# Altium schematic sheet 02_ESP12.SchDoc: ESP12 Housing Board
size A4; SheetNumber: 1; SheetTotal: 3; PageSetup: Record=PageOptions|CenterHorizontal=True|CenterVertical=True|PrintScale=1.09|XCorrection=1.00|YCorrection=1.00|PrintKind=0|BorderSize=5000000|LeftOffset=0|BottomOffset=0|Orientation=2|PaperLength=1000|PaperWidth=1000|Scale=100|PaperSource=7|PrintQuality=-3|MediaType=1|DitherType=10|PrintScaleMode=1|PaperKind=A4|PaperIndex=9; SK_ProjectName: ESP8266 IoT Dimmer; Version: R01
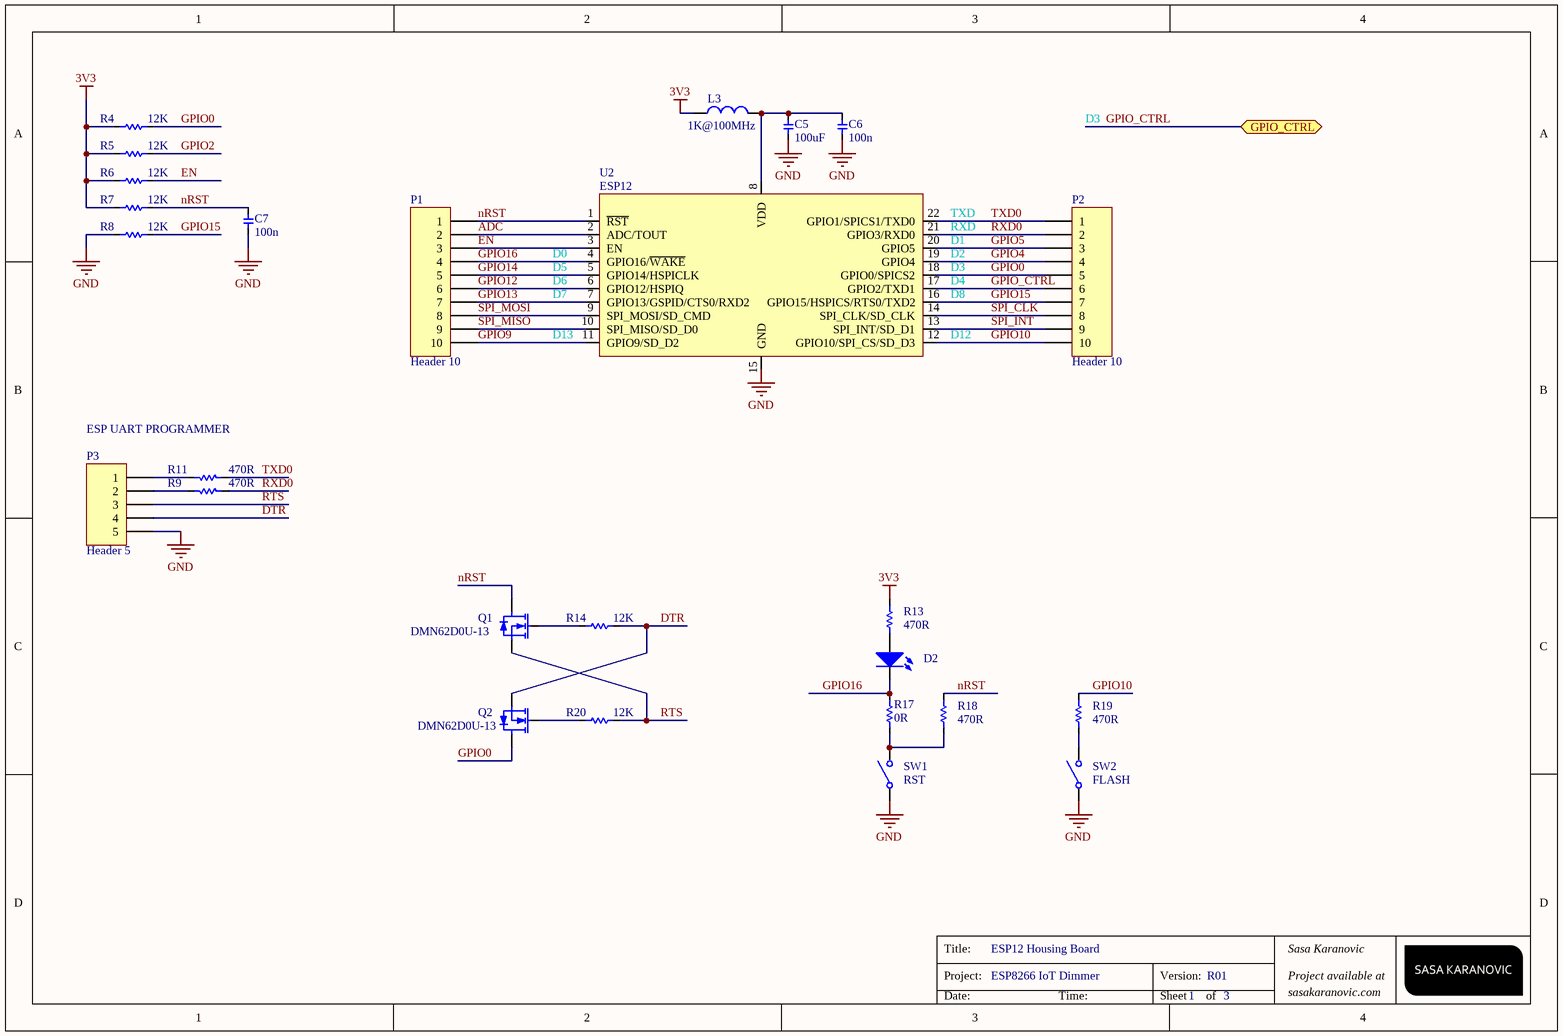
[diagram p0: 02_ESP12.SchDoc]

## Parts
C5  value 100uF  [CAPC_1411_3528_X08N]  (hidden comment: Cap)
C6  value 100n  [0603 - CAP]  (hidden comment: Cap)
C7  value 100n  [0603 - CAP]  (hidden comment: Cap)
D2  LED  [0603 Diode]  (value not drawn)
L3  value 1K@100MHz  [0603]  (hidden comment: Inductor)
P1  Header 10  [HDR1X10]
P2  Header 10  [HDR1X10]
P3  Header 5  [Header 5x1]
Q1  DMN62D0U-13  [SOT90P240X100-3N]
Q2  DMN62D0U-13  [SOT90P240X100-3N]
R4  value 12K  [0603]  (hidden comment: Res)
R5  value 12K  [0603]  (hidden comment: Res)
R6  value 12K  [0603]  (hidden comment: Res)
R7  value 12K  [0603]  (hidden comment: Res)
R8  value 12K  [0603]  (hidden comment: Res)
R9  value 470R  [0603]  (hidden comment: Res)
R11  value 470R  [0603]  (hidden comment: Res)
R13  value 470R  [0603]  (hidden comment: Res)
R14  value 12K  [0603]  (hidden comment: Res)
R17  value 0R  [0603]  (hidden comment: Res)
R18  value 470R  [0603]  (hidden comment: Res)
R19  value 470R  [0603]  (hidden comment: Res)
R20  value 12K  [0603]  (hidden comment: Res)
SW1  Switch  [SMD Switch 2pin]  (value not drawn)
SW2  Switch  [SMD Switch 2pin]  (value not drawn)
U2  ESP12  [ESP-12]

## Ports
GPIO_CTRL (bidir)

## Nets
3V3: L3.1 R4.1 R5.1 R6.1 R7.1 R13.2
GND: C5.1 C6.1 C7.1 P3.5 R8.1 SW1.1(COMMON1) SW2.1(COMMON1) U2.15(GND)
ADC: P1.2 U2.2(ADC/TOUT)
DTR: P3.4 Q2.3(S) R14.2
EN: P1.3 R6.2 U2.3(EN)
GPIO0: P2.5 Q2.2(D) R4.2 U2.18(GPIO0/SPICS2)
GPIO2: R5.2
GPIO4: P2.4 U2.19(GPIO4)
GPIO5: P2.3 U2.20(GPIO5)
GPIO9: P1.10 U2.11(GPIO9/SD_D2)
GPIO10: P2.10 R19.2 U2.12(GPIO10/SPI_CS/SD_D3)
GPIO12: P1.6 U2.6(GPIO12/HSPIQ)
GPIO13: P1.7 U2.7(GPIO13/GSPID/CTS0/RXD2)
GPIO14: P1.5 U2.5(GPIO14/HSPICLK)
GPIO15: P2.7 R8.2 U2.16(GPIO15/HSPICS/RTS0/TXD2)
GPIO16: D2.K P1.4 R17.1 U2.4(GPIO16/~{WAKE})
GPIO_CTRL: P2.6 U2.17(GPIO2/TXD1) ; port GPIO_CTRL
nRST: C7.2 P1.1 Q1.2(D) R7.2 R18.2 U2.1(~{RST})
RTS: P3.3 Q1.3(S) R20.2
RXD0: P2.2 R9.2 U2.21(GPIO3/RXD0)
SPI_CLK: P2.8 U2.14(SPI_CLK/SD_CLK)
SPI_INT: P2.9 U2.13(SPI_INT/SD_D1)
SPI_MISO: P1.9 U2.10(SPI_MISO/SD_D0)
SPI_MOSI: P1.8 U2.9(SPI_MOSI/SD_CMD)
TXD0: P2.1 R11.2 U2.22(GPIO1/SPICS1/TXD0)
NetC5_2: C5.2 C6.2 L3.2 U2.8(VDD)
NetD2_A: D2.A R13.1
NetP3_1: P3.1 R11.1
NetP3_2: P3.2 R9.1
NetQ1_1: Q1.1(G) R14.1
NetQ2_1: Q2.1(G) R20.1
NetR17_2: R17.2 R18.1 SW1.2(COMMON2)
NetR19_1: R19.1 SW2.2(COMMON2)

## Notes on the sheet
- D3
- (near U2) TXD
- (near U2) RXD
- (near U2) D1
- (near U2) D0
- (near U2) D5
- (near U2) D6
- (near U2) D7
- (near U2) D2
- (near U2) D3
- (near U2) D4
- (near U2) D8
- (near U2) D13
- (near U2) D12
- ESP UART PROGRAMMER
- (near SW1) RST
- (near SW2) FLASH
- Title:
- Project:
- Version:
- sasakaranovic.com
- Sasa Karanovic
- Project available at
- Date:
- Time:
- Sheet
- of

## Library data of the parts
C5 = Cap: Capacitor; Manufacturer: AVX Corporation; Manufacturer Part Number: TAJB107M006RNJ; Distributor Part Number: 478-3877-1-ND; Distributor: DigiKey
C6 C7 = Cap: Capacitor; Manufacturer: AVX Corporation; Manufacturer Part Number: 06035C104KAT2A; Distributor Part Number: 478-5052-1-ND; Distributor: DigiKey
D2 = LED: Typical RED GaAs LED; Manufacturer: Lite-On Inc.; Manufacturer Part Number: LTST-C193KRKT-5A; Distributor: DigiKey; Distributor Part Number: 160-1830-1-ND
L3 = Inductor: FERRITE BEAD 1 KOHM 0603 1LN; Manufacturer: TDK Corporation; Manufacturer Part Number: MPZ1608S102ATA00; Distributor: DigiKey; Distributor Part Number: 445-8694-1-ND
P1 P2 = Header 10: Header, 10-Pin; Manufacturer: Harwin Inc.; Manufacturer Part Number: M20-9991046; Distributor: DigiKey; Distributor Part Number: 952-1843-ND
P3 = Header 5: SIL VERTICAL PC TAIL PIN HEADER; Manufacturer: Harwin Inc.; Manufacturer Part Number: M20-9990546; Distributor: DigiKey; Distributor Part Number: 952-2268-ND
Q1 Q2 = DMN62D0U-13: MOSFET N-CH 60V 0.38A; pin to pad: 1>2 2>3 3>1; Manufacturer: Diodes Incorporated; Manufacturer Part Number: DMN62D0U-13; Distributor: DigiKey; Distributor Part Number: DMN62D0U-13DICT-ND
R4-R8 R14 R20 = Res: Resistor; Manufacturer: Yageo; Manufacturer Part Number: RT0603FRE0712KL; Distributor: DigiKey; Distributor Part Number: YAG3353TR-ND
R9 R11 R13 R18 R19 = Res: Resistor; Manufacturer: Yageo; Manufacturer Part Number: AC0603FR-07470RL; Distributor: DigiKey; Distributor Part Number: 311-470LDCT-ND
R17 = Res: Resistor; Manufacturer: Yageo; Manufacturer Part Number: RC0603JR-070RL; Distributor: DigiKey; Distributor Part Number: 311-0.0GRCT-ND
SW1 SW2 = Switch: Manufacturer: Harwin Inc.; Manufacturer Part Number: M20-9991046; Distributor: DigiKey; Distributor Part Number: 952-1843-ND
U2 = ESP12: ESP8266 SMT Module - ESP-12S; Manufacturer: Seeed Technology Co., Ltd; Manufacturer Part Number: 317060015; Distributor: DigiKey/eBay; Distributor Part Number: 317060015-ND